# Altium schematic sheet 09_Antenna.SchDoc
size A
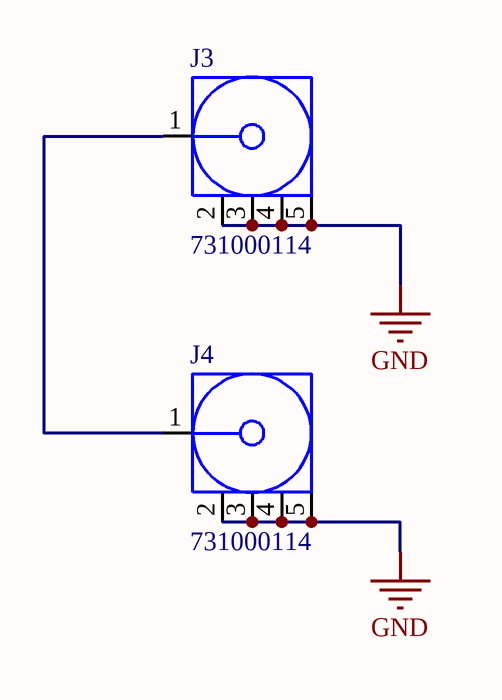
[diagram p0: 09_Antenna.SchDoc]

## Parts
J3  731000114  [MOLX-731000114_V]
J4  731000114  [MOLX-731000114_V]

## Nets
GND: J3.2 J3.3 J3.4 J3.5 J4.2 J4.3 J4.4 J4.5
NetJ3_1: J3.1 J4.1

## Library data of the parts
J3 J4 = CMP-2000-05487-1: SMA Right-Angle PCB Jack Receptacle, Brass Body, Gold Plated, 50 Ohm, 5-Pin THD, RoHS, Tray; Manufacturer: Molex; Datasheet Version: 09/2016; Package Description: 5-Pin Through Hole Device, Body 14.8 x 6.35 mm, Pitch 2.54 mm; Datasheet URL: http://www.molex.com/webdocs/datasheets/pdf/en-us/0731000114_RF_COAX_CONNECTORS.pdf; Manufacturer URL: http://www.molex.com/; Package Reference: 731000114; Mounting Technology: ThroughHole; Package URL: http://www.molex.com/pdm_docs/sd/731000114_sd.pdf